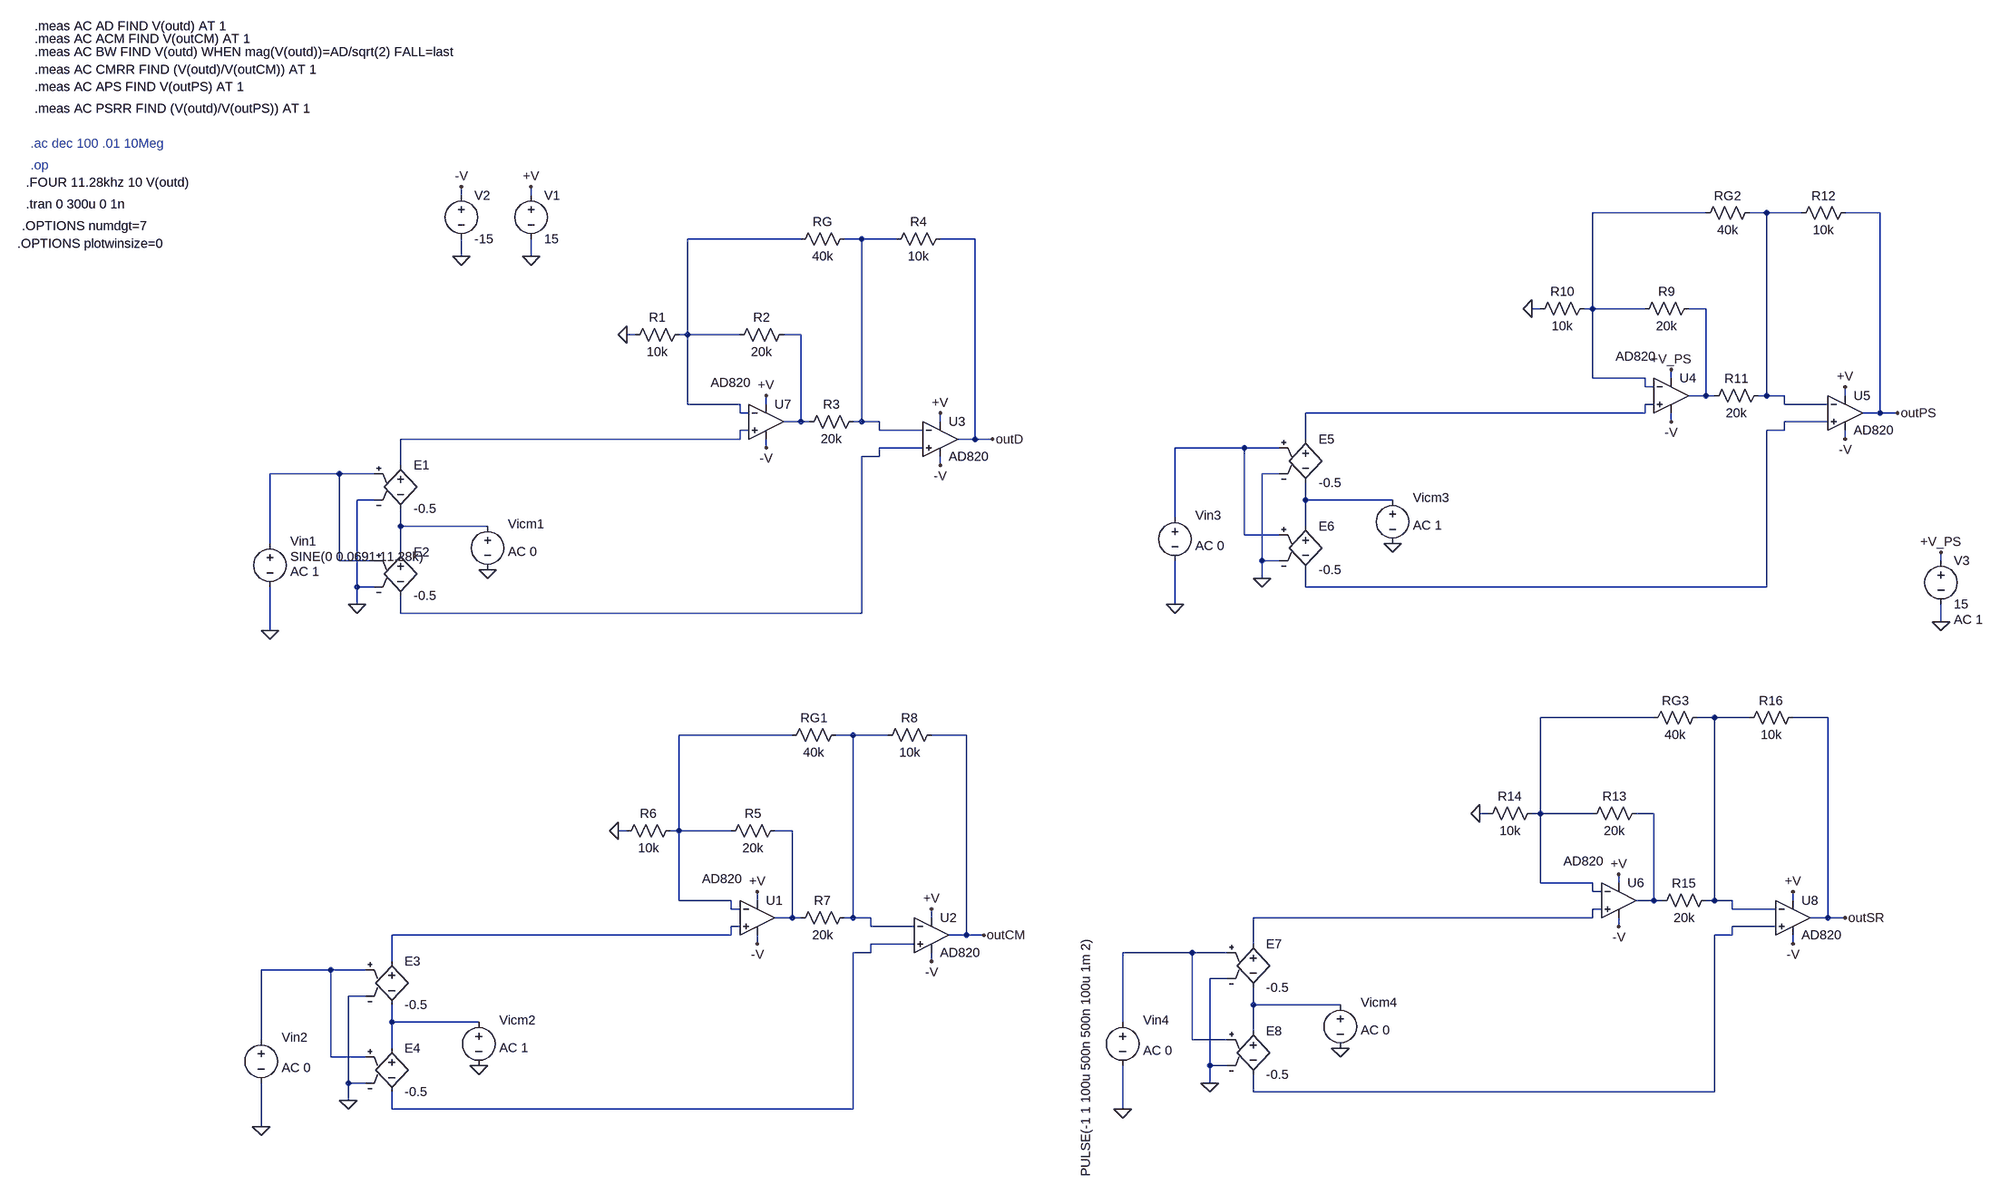
[diagram p0: schematic Etaj1.asc]
Etaj1.asc, the LTspice schematic file:
Version 4
SHEET 1 2624 2596
WIRE -352 -176 -352 -192
WIRE -224 -176 -224 -192
WIRE 2112 -144 1904 -144
WIRE 2224 -144 2192 -144
WIRE 2288 -144 2224 -144
WIRE 2432 -144 2368 -144
WIRE 272 -96 64 -96
WIRE 384 -96 352 -96
WIRE 448 -96 384 -96
WIRE 592 -96 528 -96
WIRE -352 -64 -352 -96
WIRE -224 -64 -224 -96
WIRE 1808 32 1792 32
WIRE 1904 32 1904 -144
WIRE 1904 32 1888 32
WIRE 2000 32 1904 32
WIRE 2112 32 2080 32
WIRE -32 80 -48 80
WIRE 64 80 64 -96
WIRE 64 80 48 80
WIRE 160 80 64 80
WIRE 272 80 240 80
WIRE 1904 160 1904 32
WIRE 2000 160 1904 160
WIRE 2048 160 2048 144
WIRE 2000 176 2000 160
WIRE 2016 176 2000 176
WIRE 2112 192 2112 32
WIRE 2112 192 2080 192
WIRE 2128 192 2112 192
WIRE 2224 192 2224 -144
WIRE 2224 192 2208 192
WIRE 2256 192 2224 192
WIRE 2368 192 2368 176
WIRE 64 208 64 80
WIRE 160 208 64 208
WIRE 208 208 208 192
WIRE 2016 208 2000 208
WIRE 2256 208 2256 192
WIRE 2336 208 2256 208
WIRE 160 224 160 208
WIRE 176 224 160 224
WIRE 2000 224 2000 208
WIRE 2000 224 1376 224
WIRE 2432 224 2432 -144
WIRE 2432 224 2400 224
WIRE 2464 224 2432 224
WIRE 272 240 272 80
WIRE 272 240 240 240
WIRE 288 240 272 240
WIRE 384 240 384 -96
WIRE 384 240 368 240
WIRE 416 240 384 240
WIRE 528 240 528 224
WIRE 2048 240 2048 224
WIRE 2336 240 2256 240
WIRE 176 256 160 256
WIRE 416 256 416 240
WIRE 496 256 416 256
WIRE 2256 256 2256 240
WIRE 2256 256 2224 256
WIRE 160 272 160 256
WIRE 160 272 -464 272
WIRE 592 272 592 -96
WIRE 592 272 560 272
WIRE 624 272 592 272
WIRE 1376 272 1376 224
WIRE 2368 272 2368 256
WIRE 208 288 208 272
WIRE 496 288 416 288
WIRE 1264 288 1136 288
WIRE 1328 288 1264 288
WIRE 416 304 416 288
WIRE 416 304 384 304
WIRE -464 320 -464 272
WIRE 528 320 528 304
WIRE -576 336 -704 336
WIRE -512 336 -576 336
WIRE 1328 336 1296 336
WIRE -512 384 -544 384
WIRE 1376 384 1376 352
WIRE 1536 384 1376 384
WIRE 1136 416 1136 288
WIRE -464 432 -464 400
WIRE -304 432 -464 432
WIRE 1376 432 1376 384
WIRE 1264 448 1264 288
WIRE 1328 448 1264 448
WIRE -704 464 -704 336
WIRE -464 480 -464 432
WIRE -576 496 -576 336
WIRE -512 496 -576 496
WIRE 1296 496 1296 336
WIRE 1328 496 1296 496
WIRE 2544 496 2544 480
WIRE 1296 528 1296 496
WIRE -544 544 -544 384
WIRE -512 544 -544 544
WIRE 1376 544 1376 512
WIRE 2224 544 2224 256
WIRE 2224 544 1376 544
WIRE -544 576 -544 544
WIRE 1136 576 1136 496
WIRE -464 592 -464 560
WIRE 384 592 384 304
WIRE 384 592 -464 592
WIRE 2544 608 2544 576
WIRE -704 624 -704 544
WIRE 2016 816 1808 816
WIRE 2128 816 2096 816
WIRE 2192 816 2128 816
WIRE 2336 816 2272 816
WIRE 256 848 48 848
WIRE 368 848 336 848
WIRE 432 848 368 848
WIRE 576 848 512 848
WIRE 1712 992 1696 992
WIRE 1808 992 1808 816
WIRE 1808 992 1792 992
WIRE 1904 992 1808 992
WIRE 2016 992 1984 992
WIRE -48 1024 -64 1024
WIRE 48 1024 48 848
WIRE 48 1024 32 1024
WIRE 144 1024 48 1024
WIRE 256 1024 224 1024
WIRE 1808 1120 1808 992
WIRE 1904 1120 1808 1120
WIRE 1952 1120 1952 1104
WIRE 1904 1136 1904 1120
WIRE 1920 1136 1904 1136
WIRE 48 1152 48 1024
WIRE 144 1152 48 1152
WIRE 192 1152 192 1136
WIRE 2016 1152 2016 992
WIRE 2016 1152 1984 1152
WIRE 2032 1152 2016 1152
WIRE 2128 1152 2128 816
WIRE 2128 1152 2112 1152
WIRE 2160 1152 2128 1152
WIRE 2272 1152 2272 1136
WIRE 144 1168 144 1152
WIRE 160 1168 144 1168
WIRE 1920 1168 1904 1168
WIRE 2160 1168 2160 1152
WIRE 2240 1168 2160 1168
WIRE 256 1184 256 1024
WIRE 256 1184 224 1184
WIRE 272 1184 256 1184
WIRE 368 1184 368 848
WIRE 368 1184 352 1184
WIRE 400 1184 368 1184
WIRE 512 1184 512 1168
WIRE 1904 1184 1904 1168
WIRE 1904 1184 1280 1184
WIRE 2336 1184 2336 816
WIRE 2336 1184 2304 1184
WIRE 2368 1184 2336 1184
WIRE 160 1200 144 1200
WIRE 400 1200 400 1184
WIRE 480 1200 400 1200
WIRE 1952 1200 1952 1184
WIRE 2240 1200 2160 1200
WIRE 144 1216 144 1200
WIRE 144 1216 -480 1216
WIRE 576 1216 576 848
WIRE 576 1216 544 1216
WIRE 608 1216 576 1216
WIRE 2160 1216 2160 1200
WIRE 2160 1216 2128 1216
WIRE 192 1232 192 1216
WIRE 480 1232 400 1232
WIRE 1280 1232 1280 1184
WIRE 2272 1232 2272 1216
WIRE 400 1248 400 1232
WIRE 400 1248 368 1248
WIRE 1168 1248 1040 1248
WIRE 1232 1248 1168 1248
WIRE -480 1264 -480 1216
WIRE 512 1264 512 1248
WIRE -592 1280 -720 1280
WIRE -528 1280 -592 1280
WIRE 1232 1296 1200 1296
WIRE -528 1328 -560 1328
WIRE 1280 1344 1280 1312
WIRE 1440 1344 1280 1344
WIRE -480 1376 -480 1344
WIRE -320 1376 -480 1376
WIRE 1040 1376 1040 1248
WIRE 1280 1392 1280 1344
WIRE -720 1408 -720 1280
WIRE 1168 1408 1168 1248
WIRE 1232 1408 1168 1408
WIRE -480 1424 -480 1376
WIRE -592 1440 -592 1280
WIRE -528 1440 -592 1440
WIRE 1200 1456 1200 1296
WIRE 1232 1456 1200 1456
WIRE -560 1488 -560 1328
WIRE -528 1488 -560 1488
WIRE 1200 1488 1200 1456
WIRE 1280 1504 1280 1472
WIRE 2128 1504 2128 1216
WIRE 2128 1504 1280 1504
WIRE -560 1520 -560 1488
WIRE -480 1536 -480 1504
WIRE 368 1536 368 1248
WIRE 368 1536 -480 1536
WIRE 1040 1536 1040 1456
WIRE -720 1568 -720 1488
FLAG -224 -64 0
FLAG 208 192 +V
FLAG -224 -192 +V
FLAG 208 288 -V
FLAG -352 -64 0
FLAG -352 -192 -V
FLAG -48 80 0
FLAG 528 224 +V
FLAG 528 320 -V
FLAG 624 272 outD
FLAG -704 624 0
FLAG -544 576 0
FLAG -304 512 0
FLAG 192 1136 +V
FLAG 192 1232 -V
FLAG -64 1024 0
FLAG 512 1168 +V
FLAG 512 1264 -V
FLAG 608 1216 outCM
FLAG -720 1568 0
FLAG -560 1520 0
FLAG -320 1456 0
FLAG 2048 144 +V_PS
FLAG 2048 240 -V
FLAG 1792 32 0
FLAG 2368 176 +V
FLAG 2368 272 -V
FLAG 2464 224 outPS
FLAG 1136 576 0
FLAG 1296 528 0
FLAG 1536 464 0
FLAG 2544 608 0
FLAG 2544 480 +V_PS
FLAG 1952 1104 +V
FLAG 1952 1200 -V
FLAG 1696 992 0
FLAG 2272 1136 +V
FLAG 2272 1232 -V
FLAG 2368 1184 outSR
FLAG 1040 1536 0
FLAG 1200 1488 0
FLAG 1440 1424 0
SYMBOL voltage -224 -192 R0
WINDOW 123 0 0 Left 2
WINDOW 39 0 0 Left 2
SYMATTR InstName V1
SYMATTR Value 15
SYMBOL voltage -352 -192 R0
WINDOW 123 0 0 Left 2
WINDOW 39 0 0 Left 2
SYMATTR InstName V2
SYMATTR Value -15
SYMBOL res 256 64 R90
WINDOW 0 0 56 VBottom 2
WINDOW 3 32 56 VTop 2
SYMATTR InstName R2
SYMATTR Value 20k
SYMBOL res 64 64 R90
WINDOW 0 0 56 VBottom 2
WINDOW 3 32 56 VTop 2
SYMATTR InstName R1
SYMATTR Value 10k
SYMBOL res 368 -112 R90
WINDOW 0 0 56 VBottom 2
WINDOW 3 32 56 VTop 2
SYMATTR InstName RG
SYMATTR Value 40k
SYMBOL res 384 224 R90
WINDOW 0 0 56 VBottom 2
WINDOW 3 32 56 VTop 2
SYMATTR InstName R3
SYMATTR Value 20k
SYMBOL res 544 -112 R90
WINDOW 0 0 56 VBottom 2
WINDOW 3 32 56 VTop 2
SYMATTR InstName R4
SYMATTR Value 10k
SYMBOL voltage -704 448 R0
WINDOW 123 38 68 Left 2
WINDOW 39 0 0 Left 2
WINDOW 0 38 12 Left 2
WINDOW 3 38 40 Left 2
SYMATTR Value2 AC 1
SYMATTR InstName Vin1
SYMATTR Value SINE(0 0.0691 11.28k)
SYMBOL e -464 304 R0
SYMATTR InstName E1
SYMATTR Value -0.5
SYMBOL e -464 464 R0
SYMATTR InstName E2
SYMATTR Value -0.5
SYMBOL voltage -304 416 R0
WINDOW 123 38 63 Left 2
WINDOW 39 0 0 Left 2
WINDOW 0 38 12 Left 2
WINDOW 3 -188 38 Left 2
SYMATTR Value2 AC 0
SYMATTR InstName Vicm1
SYMATTR Value ""
SYMBOL OpAmps\\AD820 208 176 R0
WINDOW 3 -102 -8 Left 2
SYMATTR InstName U7
SYMBOL OpAmps\\AD820 528 208 R0
SYMATTR InstName U3
SYMBOL res 240 1008 R90
WINDOW 0 0 56 VBottom 2
WINDOW 3 32 56 VTop 2
SYMATTR InstName R5
SYMATTR Value 20k
SYMBOL res 48 1008 R90
WINDOW 0 0 56 VBottom 2
WINDOW 3 32 56 VTop 2
SYMATTR InstName R6
SYMATTR Value 10k
SYMBOL res 352 832 R90
WINDOW 0 0 56 VBottom 2
WINDOW 3 32 56 VTop 2
SYMATTR InstName RG1
SYMATTR Value 40k
SYMBOL res 368 1168 R90
WINDOW 0 0 56 VBottom 2
WINDOW 3 32 56 VTop 2
SYMATTR InstName R7
SYMATTR Value 20k
SYMBOL res 528 832 R90
WINDOW 0 0 56 VBottom 2
WINDOW 3 32 56 VTop 2
SYMATTR InstName R8
SYMATTR Value 10k
SYMBOL voltage -720 1392 R0
WINDOW 123 38 68 Left 2
WINDOW 39 0 0 Left 2
WINDOW 0 38 12 Left 2
WINDOW 3 38 40 Left 2
SYMATTR Value2 AC 0
SYMATTR InstName Vin2
SYMATTR Value ""
SYMBOL e -480 1248 R0
SYMATTR InstName E3
SYMATTR Value -0.5
SYMBOL e -480 1408 R0
SYMATTR InstName E4
SYMATTR Value -0.5
SYMBOL voltage -320 1360 R0
WINDOW 123 38 63 Left 2
WINDOW 39 0 0 Left 2
WINDOW 0 38 12 Left 2
WINDOW 3 -188 38 Left 2
SYMATTR Value2 AC 1
SYMATTR InstName Vicm2
SYMATTR Value ""
SYMBOL OpAmps\\AD820 192 1120 R0
WINDOW 3 -102 -8 Left 2
SYMATTR InstName U1
SYMBOL OpAmps\\AD820 512 1152 R0
SYMATTR InstName U2
SYMBOL res 2096 16 R90
WINDOW 0 0 56 VBottom 2
WINDOW 3 32 56 VTop 2
SYMATTR InstName R9
SYMATTR Value 20k
SYMBOL res 1904 16 R90
WINDOW 0 0 56 VBottom 2
WINDOW 3 32 56 VTop 2
SYMATTR InstName R10
SYMATTR Value 10k
SYMBOL res 2208 -160 R90
WINDOW 0 0 56 VBottom 2
WINDOW 3 32 56 VTop 2
SYMATTR InstName RG2
SYMATTR Value 40k
SYMBOL res 2224 176 R90
WINDOW 0 0 56 VBottom 2
WINDOW 3 32 56 VTop 2
SYMATTR InstName R11
SYMATTR Value 20k
SYMBOL res 2384 -160 R90
WINDOW 0 0 56 VBottom 2
WINDOW 3 32 56 VTop 2
SYMATTR InstName R12
SYMATTR Value 10k
SYMBOL voltage 1136 400 R0
WINDOW 123 38 68 Left 2
WINDOW 39 0 0 Left 2
WINDOW 0 38 12 Left 2
WINDOW 3 38 40 Left 2
SYMATTR Value2 AC 0
SYMATTR InstName Vin3
SYMATTR Value ""
SYMBOL e 1376 256 R0
SYMATTR InstName E5
SYMATTR Value -0.5
SYMBOL e 1376 416 R0
SYMATTR InstName E6
SYMATTR Value -0.5
SYMBOL voltage 1536 368 R0
WINDOW 123 38 63 Left 2
WINDOW 39 0 0 Left 2
WINDOW 0 38 12 Left 2
WINDOW 3 -188 38 Left 2
SYMATTR Value2 AC 1
SYMATTR InstName Vicm3
SYMATTR Value ""
SYMBOL OpAmps\\AD820 2048 128 R0
WINDOW 3 -102 -8 Left 2
SYMATTR InstName U4
SYMBOL OpAmps\\AD820 2368 160 R0
SYMATTR InstName U5
SYMBOL voltage 2544 480 R0
WINDOW 123 24 124 Left 2
WINDOW 39 0 0 Left 2
SYMATTR Value2 AC 1
SYMATTR InstName V3
SYMATTR Value 15
SYMBOL res 2000 976 R90
WINDOW 0 0 56 VBottom 2
WINDOW 3 32 56 VTop 2
SYMATTR InstName R13
SYMATTR Value 20k
SYMBOL res 1808 976 R90
WINDOW 0 0 56 VBottom 2
WINDOW 3 32 56 VTop 2
SYMATTR InstName R14
SYMATTR Value 10k
SYMBOL res 2112 800 R90
WINDOW 0 0 56 VBottom 2
WINDOW 3 32 56 VTop 2
SYMATTR InstName RG3
SYMATTR Value 40k
SYMBOL res 2128 1136 R90
WINDOW 0 0 56 VBottom 2
WINDOW 3 32 56 VTop 2
SYMATTR InstName R15
SYMATTR Value 20k
SYMBOL res 2288 800 R90
WINDOW 0 0 56 VBottom 2
WINDOW 3 32 56 VTop 2
SYMATTR InstName R16
SYMATTR Value 10k
SYMBOL voltage 1040 1360 R0
WINDOW 123 38 68 Left 2
WINDOW 39 0 0 Left 2
WINDOW 0 38 12 Left 2
WINDOW 3 -67 300 VLeft 2
SYMATTR Value2 AC 0
SYMATTR InstName Vin4
SYMATTR Value PULSE(-1 1 100u 500n 500n 100u 1m 2)
SYMBOL e 1280 1216 R0
SYMATTR InstName E7
SYMATTR Value -0.5
SYMBOL e 1280 1376 R0
SYMATTR InstName E8
SYMATTR Value -0.5
SYMBOL voltage 1440 1328 R0
WINDOW 123 38 63 Left 2
WINDOW 39 0 0 Left 2
WINDOW 0 38 12 Left 2
WINDOW 3 -188 38 Left 2
SYMATTR Value2 AC 0
SYMATTR InstName Vicm4
SYMATTR Value ""
SYMBOL OpAmps\\AD820 1952 1088 R0
WINDOW 3 -102 -8 Left 2
SYMATTR InstName U6
SYMBOL OpAmps\\AD820 2272 1120 R0
SYMATTR InstName U8
TEXT -1144 -272 Left 2 ;.ac dec 100 .01 10Meg
TEXT -1136 -488 Left 2 !.meas AC AD FIND V(outd) AT 1
TEXT -1136 -464 Left 2 !.meas AC ACM FIND V(outCM) AT 1
TEXT -1136 -440 Left 2 !.meas AC BW FIND V(outd) WHEN mag(V(outd))=AD/sqrt(2) FALL=last
TEXT -1136 -408 Left 2 !.meas AC CMRR FIND (V(outd)/V(outCM)) AT 1
TEXT -1136 -336 Left 2 !.meas AC PSRR FIND (V(outd)/V(outPS)) AT 1
TEXT -1136 -376 Left 2 !.meas AC APS FIND V(outPS) AT 1
TEXT -1144 -232 Left 2 ;.op
TEXT -1152 -200 Left 2 !.FOUR 11.28khz 10 V(outd)
TEXT -1152 -160 Left 2 !.tran 0 300u 0 1n
TEXT -1160 -120 Left 2 !.OPTIONS numdgt=7
TEXT -1168 -88 Left 2 !.OPTIONS plotwinsize=0

The netlist it stands for:
* Etaj1.asc
V1 +V 0 15
V2 -V 0 -15
R2 N006 N003 20k
R1 N003 0 10k
RG N004 N003 40k
R3 N004 N006 20k
R4 outD N004 10k
Vin1 N012 0 SINE(0 0.0691 11.28k) AC 1
E1 N009 N014 N012 0 -0.5
E2 N014 N010 N012 0 -0.5
Vicm1 N014 0 AC 0
XU7 N009 N003 +V -V N006 AD820  ; pins In+ In- V+ V- OUT
XU3 N010 N004 +V -V outD AD820  ; pins In+ In- V+ V- OUT
R5 N020 N017 20k
R6 N017 0 10k
RG1 N018 N017 40k
R7 N018 N020 20k
R8 outCM N018 10k
Vin2 N026 0 AC 0
E3 N022 N028 N026 0 -0.5
E4 N028 N024 N026 0 -0.5
Vicm2 N028 0 AC 1
XU1 N022 N017 +V -V N020 AD820  ; pins In+ In- V+ V- OUT
XU2 N024 N018 +V -V outCM AD820  ; pins In+ In- V+ V- OUT
R9 N005 N001 20k
R10 N001 0 10k
RG2 N002 N001 40k
R11 N002 N005 20k
R12 outPS N002 10k
Vin3 N011 0 AC 0
E5 N007 N013 N011 0 -0.5
E6 N013 N008 N011 0 -0.5
Vicm3 N013 0 AC 1
XU4 N007 N001 +V_PS -V N005 AD820  ; pins In+ In- V+ V- OUT
XU5 N008 N002 +V -V outPS AD820  ; pins In+ In- V+ V- OUT
V3 +V_PS 0 15 AC 1
R13 N019 N015 20k
R14 N015 0 10k
RG3 N016 N015 40k
R15 N016 N019 20k
R16 outSR N016 10k
Vin4 N025 0 PULSE(-1 1 100u 500n 500n 100u 1m 2) AC 0
E7 N021 N027 N025 0 -0.5
E8 N027 N023 N025 0 -0.5
Vicm4 N027 0 AC 0
XU6 N021 N015 +V -V N019 AD820  ; pins In+ In- V+ V- OUT
XU8 N023 N016 +V -V outSR AD820  ; pins In+ In- V+ V- OUT
* .ac dec 100 .01 10Meg
.meas AC AD FIND V(outd) AT 1
.meas AC ACM FIND V(outCM) AT 1
.meas AC BW FIND V(outd) WHEN mag(V(outd))=AD/sqrt(2) FALL=last
.meas AC CMRR FIND (V(outd)/V(outCM)) AT 1
.meas AC PSRR FIND (V(outd)/V(outPS)) AT 1
.meas AC APS FIND V(outPS) AT 1
* .op
.FOUR 11.28khz 10 V(outd)
.tran 0 300u 0 1n
.OPTIONS numdgt=7
.OPTIONS plotwinsize=0
.backanno
.end